# Altium project KC_BaseBoard4CompareTest_V0.3.PrjPcb
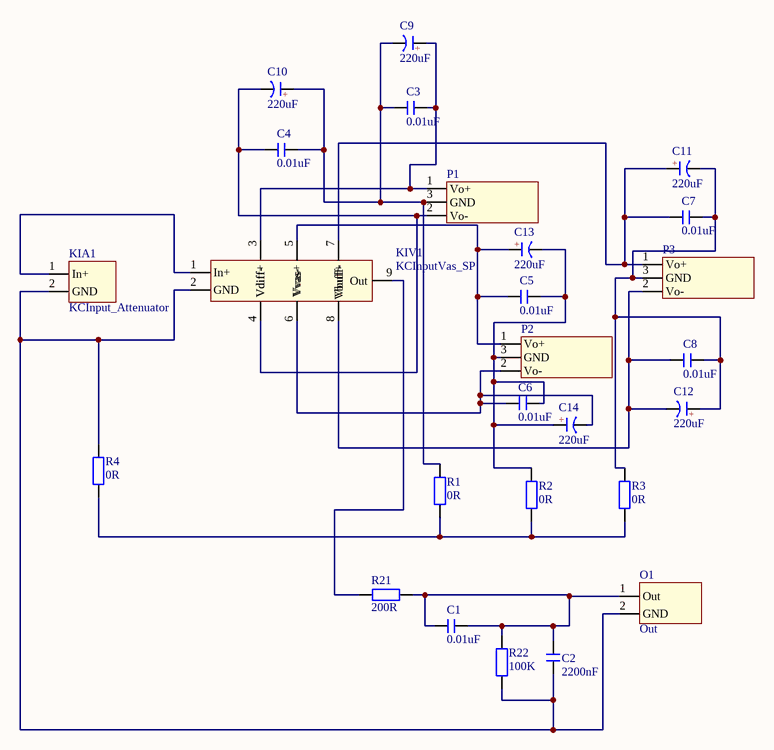
[diagram p0: KC_BaseBoard4CompareTest-V0.3.SchDoc]
1 sheet, 26 parts. Net scope: global (net labels, ports and power ports of the same name join across sheets).
Board file: KC_BaseBoard4CompareTest-V0.3.PcbDoc

## Sheet KC_BaseBoard4CompareTest-V0.3.SchDoc
size A4

### Parts
C1  0.01uF  [CBB 6.3*6.3*5]
C2  2200nF  [CBB 6.3*6.3*5]
C3  0.01uF  [CBB 6.3*6.3*5]
C4  0.01uF  [CBB 6.3*6.3*5]
C5  0.01uF  [CBB 6.3*6.3*5]
C6  0.01uF  [CBB 6.3*6.3*5]
C7  0.01uF  [CBB 6.3*6.3*5]
C8  0.01uF  [CBB 6.3*6.3*5]
C9  220uF  [CAP 5.0*10*12.5]
C10  220uF  [CAP 5.0*10*12.5]
C11  220uF  [CAP 5.0*10*12.5]
C12  220uF  [CAP 5.0*10*12.5]
C13  220uF  [CAP 5.0*10*12.5]
C14  220uF  [CAP 5.0*10*12.5]
KIA1  KCInput_Attenuator  [KCIn_Attenuator]
KIV1  KCInputVas_SP  [KCIn_VAS_SP_M4]
O1  Out  [Signal_Terminal]
P1  Vdiff  [KC_MBPowerReg4Compare]  (value not drawn)
P2  Vvas  [KC_MBPowerReg4Compare]  (value not drawn)
P3  Vbuff  [KC_MBPowerReg4Compare]  (value not drawn)
R1  0R  [RS 1/4W]
R2  0R  [RS 1/4W]
R3  0R  [RS 1/4W]
R4  0R  [RS 1/4W]
R21  200R  [RS 1/4W]
R22  100K  [RS 1/4W]

### Nets
NetC1_1: C1.1 C1.2 C2.1 O1.1(Out) R21.1 R22.1
NetC2_2: C2.2 KIA1.2(GND) KIV1.2(GND) O1.2(GND) R4.2 R22.2
NetC3_1: C3.1 C4.2 C9.2(K) C10.1(A) P1.3(GND) R1.2
NetC3_2: C3.2 C9.1(A) KIV1.3(Vdiff+) P1.1(Vo+)
NetC4_1: C4.1 C10.2(K) KIV1.4(Vdiff-) P1.2(Vo-)
NetC5_1: C5.1 C13.1(A) KIV1.5(Vvas+) P2.1(Vo+)
NetC5_2: C5.2 C6.2 C13.2(K) C14.1(A) P2.3(GND) R2.2
NetC6_1: C6.1 C14.2(K) KIV1.6(Vvas-) P2.2(Vo-)
NetC7_1: C7.1 C11.1(A) KIV1.7(Vbuff+) P3.1(Vo+)
NetC7_2: C7.2 C8.2 C11.2(K) C12.1(A) P3.3(GND) R3.2
NetC8_1: C8.1 C12.2(K) KIV1.8(Vbuff-) P3.2(Vo-)
NetKIA1_1: KIA1.1(In+) KIV1.1(In+)
NetKIV1_9: KIV1.9(Out) R21.2
NetR1_1: R1.1 R2.1 R3.1 R4.1

### Notes on the sheet
- (in symbol C-CAP) +

### Library data of the parts
C1-C8 = C-CBB: CBB电容; 版权归属: 源创客; BOM名称: CBB电容; 学习资源: www.ooocke.com
C9-C14 = C-CAP: 直插电解电容; 版权归属: 源创客; BOM名称: 直插电解电容; 学习资源: www.ooocke.com
KIA1 = KCInput_Attenuator: King Cello Input Attenuator
KIV1 = KCInputVas_SP: King Cello Input Stage and VAS for Seperated Power
O1 = Signal_Out: Signal Out
P1-P3 = MainBoardPowerRegulator4CompareTest: King Cello Compare Test Power
R1-R4 R21 R22 = R-CRR: 直插色环电阻; BOM名称: 色环电阻; 版权归属: 源创客; 学习资源: www.ooocke.com